# Altium project SwarmBot.PrjPcb
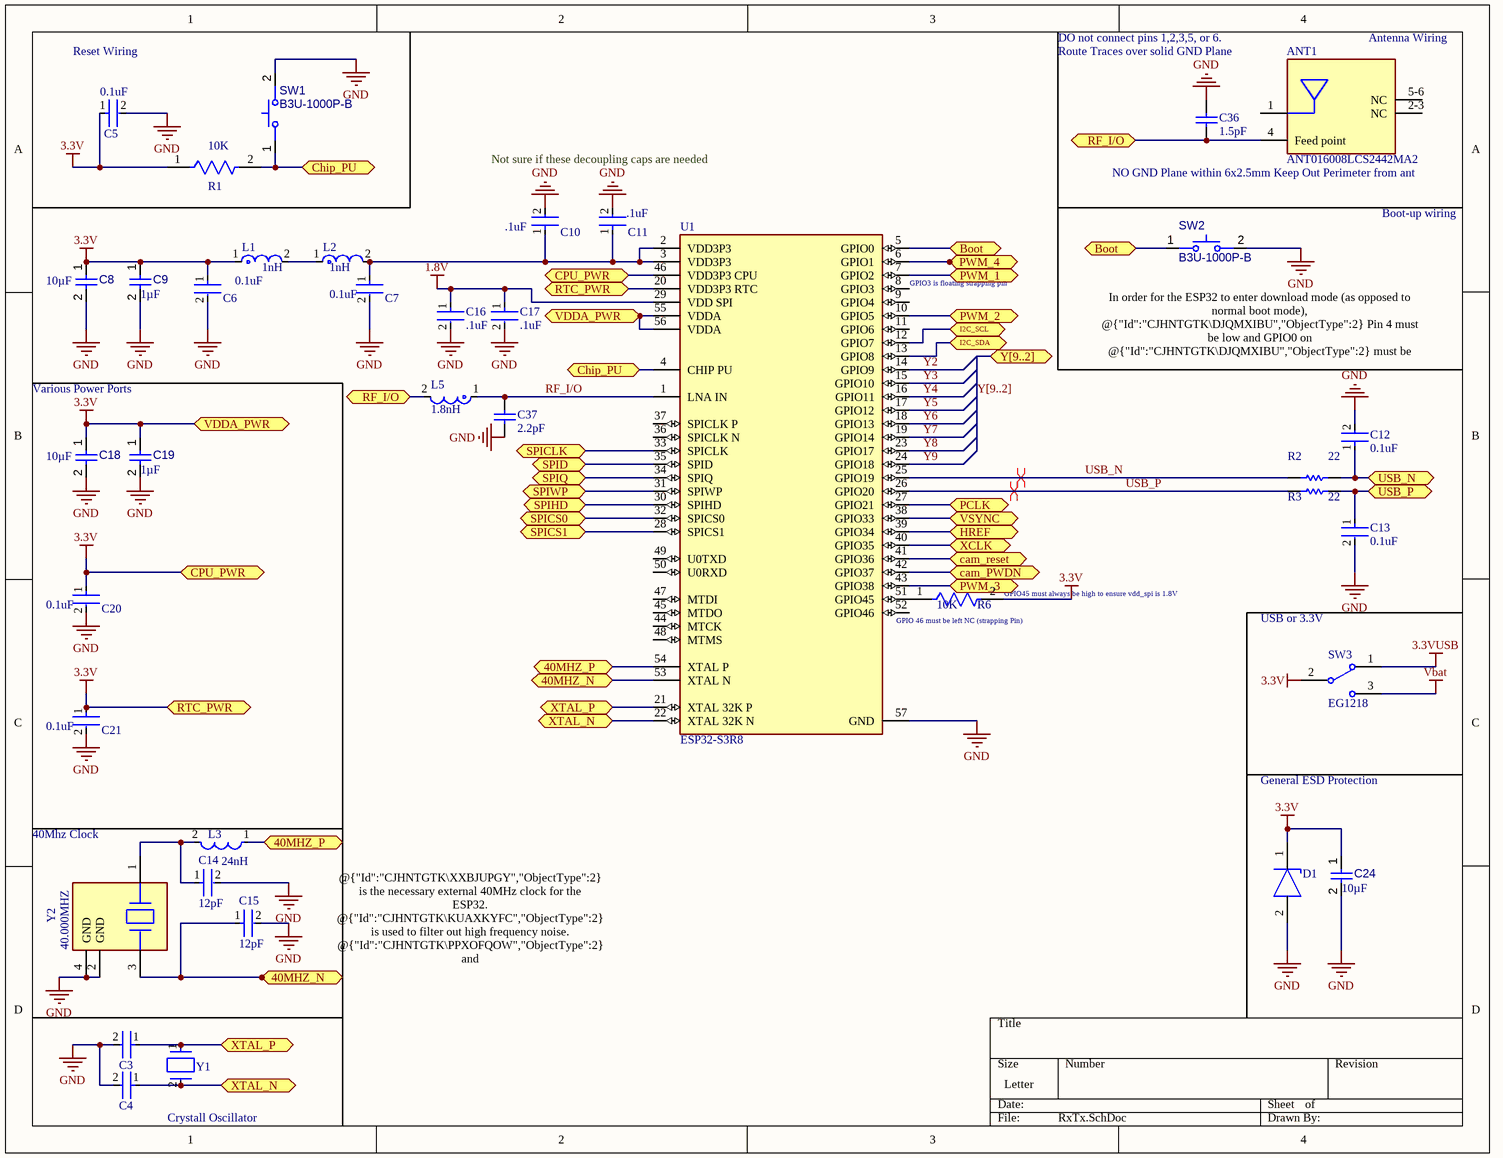
[diagram p0: RxTx.SchDoc]
CAGE_CODE: ?????; CONTRACT_NUMBER: <CONTRACT NO>; DOC_NO_ASSY_DWG: <ASSY DWG NO>; DOC_NO_BOM: <BOM DOC NO>; DOC_NO_FAB_DWG: <FAB DWG NO>; DOC_NO_SCH_DWG: <SCH DWG NO>; PCB_2_DEC_TOL: +/-.01; PCB_3_DEC_TOL: +/-.010; PCB_ANG_TOL: +/-1/2; PCB_ASSEMBLY_NO: <PCB ASSY NO>; PCB_CHECKER: - -----; PCB_CHECKER_APP_DATE: --/--/----; PCB_DESIGNER: - -----; PCB_DESIGNER_APP_DATE: --/--/----; PCB_DWG_NO: <PCB DWG NO>; PCB_ENGINEER: - -----; PCB_ENGINEER_APP_DATE: --/--/----; PCB_PART_NUMBER: <PCB PN>; PCB_REV: A; SCH_REV: A
5 sheets, 79 parts. Net scope: flat (ports and power ports of the same name join across sheets).
Board files: SwarmBotv1.PcbDoc, SwarmBotV2.PcbDoc
Sheets:
  RxTx.SchDoc
  Cam.SchDoc
  USB.SchDoc
  PowerReg.SchDoc
  Flash&PSRAM.SchDoc

## Sheet RxTx.SchDoc
size Letter; ENG_APP_DATE: --/--/--; DSN_APP_DATE: --/--/--; CHK_APP_DATE: --/--/--; SheetNumber: 1; SheetTotal: 5

### Parts
ANT1  ANT016008LCS2442MA2  [FP-ANT016008LCS2442MA2-0]
C3  GRM21A5C2E120FW01D  [FP-GRM21A-0_2-IPC_C]  (value not drawn)
C4  GRM21A5C2E120FW01D  [FP-GRM21A-0_2-IPC_C]  (value not drawn)
C5  0.1uF  [FP-GRM033-0_03-IPC_A]
C6  0.1uF  [FP-GRM033-0_03-IPC_A]
C7  0.1uF  [FP-GRM033-0_03-IPC_A]
C8  value 10µF  [CAPC0603(1608)100_L]  (hidden comment: Capacitor 10µF +/-20% 10V 0603)
C9  value 1µF  [CAPC1608X90X35ML15T15]  (hidden comment: Capacitor 1uF +/- 10% 16V 0603)
C10  .1uF  [FP-GRM033-0_03-IPC_A]
C11  .1uF  [FP-GRM033-0_03-IPC_A]
C12  0.1uF  [FP-GRM033-0_03-IPC_A]
C13  0.1uF  [FP-GRM033-0_03-IPC_A]
C14  12pF  [FP-GRM31A-0_2-e0_3_0_95-MFG]
C15  12pF  [FP-GRM31A-0_2-e0_3_0_95-MFG]
C16  .1uF  [FP-GRM033-0_03-IPC_A]
C17  .1uF  [FP-GRM033-0_03-IPC_A]
C18  value 10µF  [CAPC0603(1608)100_L]  (hidden comment: Capacitor 10µF +/-20% 10V 0603)
C19  value 1µF  [CAPC1608X90X35ML15T15]  (hidden comment: Capacitor 1uF +/- 10% 16V 0603)
C20  0.1uF  [FP-GRM033-0_03-IPC_A]
C21  0.1uF  [FP-GRM033-0_03-IPC_A]
C24  value 10µF  [CAPC0603(1608)100_L]  (hidden comment: Capacitor 10µF +/-20% 10V 0603)
C36  1.5pF  [CAPC0402(1005)60_M]
C37  2.2pF  [CAPC0402(1005)60_L]
D1  PTVS3V3P1UP,115  [FP-SOD128-MFG]  (value not drawn)
L1  1nH  [FP-LQG15HH_02-IPC_C]
L2  1nH  [FP-LQG15HH_02-IPC_C]
L3  24nH  [FP-LQW15AN_00-W0_5-0_1-MFG]
L5  1.8nH  [FP-LQG15HH_02-IPC_C]
R1  10K  [FP-CRGP0805-IPC_C]
R2  22  [RESC1005X40X25LL05T10]
R3  22  [RESC1005X40X25LL05T10]
R6  10K  [FP-CRGP0805-IPC_C]
SW1  B3U-1000P-B  [OMRON-B3U-1000P-2-B_V]
SW2  B3U-1000P-B  [OMRON-B3U-1000P-2-B_V]
SW3  EG1218  [ESWI-EG1218_V]
U1  ESP32-S3R8  [FP-ESP32-S3R8-IPC_A]
Y1  ABS07-32.768KHZ-9-T  [FP-ABS07-MFG]  (value not drawn)
Y2  40.000MHZ  [FP-ABM8-MFG]

### Ports
40MHZ_N (bidir), 40MHZ_P (bidir), Boot (bidir), cam_PWDN (bidir), cam_reset (bidir), Chip_PU (bidir), CPU_PWR (bidir), HREF (bidir), I2C_SCL (bidir), I2C_SDA (bidir), PCLK (bidir), PWM_1 (bidir), PWM_2 (bidir), PWM_3 (bidir), PWM_4 (bidir), RF_I/O (bidir), RTC_PWR (bidir), SPICLK (bidir), SPICS0 (bidir), SPICS1 (bidir), SPID (bidir), SPIHD (bidir), SPIQ (bidir), SPIWP (bidir), USB_N (bidir), USB_P (bidir), VDDA_PWR (bidir), VSYNC (bidir), XCLK (bidir), XTAL_N (bidir), XTAL_P (bidir), Y[9..2] (bidir)

### Nets
1.8V: C16.1 C17.1 U1.29(VDD_SPI)
3.3V: C5.1 C6.1 C8.1 C9.1 C18.1 C19.1 C20.1 C21.1 C24.1 D1.1(C) L1.1 R1.1 R6.2 SW3.2(COM) U1.20(VDD3P3_RTC) U1.46(VDD3P3_CPU) U1.55(VDDA) U1.56(VDDA) ; port VDDA_PWR, port CPU_PWR, port RTC_PWR
3.3VUSB: SW3.1
GND: C3.2 C4.2 C5.2 C6.2 C7.2 C8.2 C9.2 C10.2 C11.2 C12.2 C13.2 C14.2 C15.2 C16.2 C17.2 C18.2 C19.2 C20.2 C21.2 C24.2 C36.2 C37.2 D1.2(A) SW1.2 SW2.2 U1.57(GND) Y2.2(GND) Y2.4(GND)
Vbat: SW3.3
cam_reset: U1.41(GPIO36) ; port cam_reset
href: U1.39(GPIO34) ; port HREF
pclk: U1.27(GPIO21) ; port PCLK
pwdn: U1.42(GPIO37) ; port cam_PWDN
RF_I/O: C37.1 L5.1 U1.1(LNA_IN)
SCL: U1.12(GPIO7) ; port I2C_SCL
SDA: U1.13(GPIO8) ; port I2C_SDA
USB1_N: C12.1 R2.2 ; port USB_N
USB1_P: C13.1 R3.2 ; port USB_P
USB_N: R2.1 U1.25(GPIO19)
USB_P: R3.1 U1.26(GPIO20)
vsync: U1.38(GPIO33) ; port VSYNC
xclk: U1.40(GPIO35) ; port XCLK
Y2: U1.14(GPIO9)
Y3: U1.15(GPIO10)
Y4: U1.16(GPIO11)
Y5: U1.17(GPIO12)
Y6: U1.18(GPIO13)
Y7: U1.19(GPIO14)
Y8: U1.23(GPIO17)
Y9: U1.24(GPIO18)
NetANT1_4: ANT1.4(Feed_point) C36.1 L5.2 ; port RF_I/O
NetC3_1: C3.1 U1.21(XTAL_32K_P) Y1.1 ; port XTAL_P
NetC4_1: C4.1 U1.22(XTAL_32K_N) Y1.2 ; port XTAL_N
NetC7_1: C7.1 C10.1 C11.1 L2.2 U1.2(VDD3P3) U1.3(VDD3P3)
NetC14_1: C14.1 L3.2 Y2.1
NetC15_1: C15.1 U1.53(XTAL_N) Y2.3 ; port 40MHZ_N
NetL1_2: L1.2 L2.1
NetL3_1: L3.1 U1.54(XTAL_P) ; port 40MHZ_P
NetP1_2: U1.7(GPIO2) ; port PWM_1
NetP2_2: U1.10(GPIO5) ; port PWM_2
NetP3_2: U1.43(GPIO38) ; port PWM_3
NetP4_2: U1.6(GPIO1) ; port PWM_4
NetR1_2: R1.2 SW1.1 U1.4(CHIP_PU) ; port Chip_PU
NetR6_1: R6.1 U1.51(GPIO45)
NetSW2_1: SW2.1 U1.5(GPIO0) ; port Boot
NetU1_28: U1.28(SPICS1) ; port SPICS1
NetU1_30: U1.30(SPIHD) ; port SPIHD
NetU1_31: U1.31(SPIWP) ; port SPIWP
NetU1_32: U1.32(SPICS0) ; port SPICS0
NetU1_33: U1.33(SPICLK) ; port SPICLK
NetU1_34: U1.34(SPIQ) ; port SPIQ
NetU1_35: U1.35(SPID) ; port SPID

Not connected (* = marked no-connect by the designer): ANT1 1(Radiator_electrode) 2-3(NC) 5-6(NC); U1 8(GPIO3) 9(GPIO4) 11(GPIO6) 36(SPICLK_N) 37(SPICLK_P) 44(MTCK) 45(MTDO) 47(MTDI) 48(MTMS) 49(U0TXD) 50(U0RXD) 52(GPIO46)

### Buses and harness runs
bus Y[9..2] = port Y[9..2]

### Layout directives
differential pair: USB_N, USB_P

### Notes on the sheet
- Reset Wiring
- DO not connect pins 1,2,3,5, or 6.
- Route Traces over solid GND Plane
- Antenna Wiring
- Not sure if these decoupling caps are needed
- NO GND Plane within 6x2.5mm Keep Out Perimeter from ant
- Boot-up wiring
- (near U1) GPIO3 is floating strapping pin
- Type @ to refer to a designator
- (near SW2) In order for the ESP32 to enter download mode (as opposed to normal boot mode), @{"Id":"CJHNTGTK\DJQMXIBU","ObjectType":2} Pin 4 must be low and GPIO0 on @{"Id":"CJHNTGTK\DJQMXIBU","ObjectType":2} must be low. In order to achieve this press @{"Id":"CJHNTGTK\SEUIVYGS","ObjectType":2} & @{"Id":"CJHNTGTK\DHJPIHSD","ObjectType":2} @ the same time as GPIO0 is a strapping pin and has an internal PU Resistor.
- Various Power Ports
- GPIO 46 must be left NC (strapping Pin)
- (near R6) GPIO45 must always be high to ensure vdd_spi is 1.8V
- (near SW3) USB or 3.3V
- (near Y2) 40Mhz Clock
- General ESD Protection
- @{"Id":"CJHNTGTK\XXBJUPGY","ObjectType":2} is the necessary external 40MHz clock for the ESP32. @{"Id":"CJHNTGTK\KUAXKYFC","ObjectType":2} is used to filter out high frequency noise. @{"Id":"CJHNTGTK\PPXOFQOW","ObjectType":2} and @{"Id":"CJHNTGTK\RYRNBWFY","ObjectType":2} are assuming a C_stray of 4pF and using CL = C1/2 + C_stray for the formula. (This formula assumes the two capacitors have the same value).
- Crystall Oscillator

### Library data of the parts
ANT1 = CMP-08339-000002-1: RF ANT 2.4GHZ CHIP SOLDER SMD; Manufacturer: TDK Corporation; Max Frequency: 2484MHz; Impedance: 50Ω; Number Of Bands: 1; Bandwidth: 2400-2484MHz; Temperature: -40°C to +85°C; Device Class L1: Integrated Circuits (ICs); Lead Free: Yes; ComponentLink2Description: Datasheet; RoHS: TRUE; Temperature Range High: +85°C; Package: ANT016008LCS2442MA2; Temperature Range Low: -40°C; ComponentLink2URL: https://product.tdk.com/info/en/documents/data_sheet/rf_ant_ant016008lcs2442ma2_summary_en.pdf; Height: 0.4mm; Octopart: https://octopart.com/ant016008lcs2442ma2-tdk-48293801; Device Class L3: RF Antennas; Device Class L2: RF Semiconductors and Devices; Digikey Description: RF ANT 2.4GHZ CHIP SOLDER SMD; Category: Ant; Automotive: No; Manufacturer Part Number: ANT016008LCS2442MA2
C3 C4 = CMP-06035-038672-1: Chip Multilayer Ceramic Capacitors for General Purpose, 0805, 12pF, C0G, 30ppm/°C, 1%, 250V
C5-C7 C10-C13 C16 C17 C20 C21 = CMP-06035-043202-1: Chip Multilayer Ceramic Capacitors for General Purpose, 0201, 0.10uF, X7R, 15%, 10%, 16V
C8 C18 C24 = CMP-001-00075-4: Chip Capacitor, 10µF +/-20%, 10V, 0603, Thickness 1 mm; Tolerance: 10%; Voltage Rating: 10V; Max Operating Temperature: 85°C; Pins: 2; Case/Package: 0603; Mounting Technology: SMT; Min Operating Temperature: -55°C
C9 C19 = CMP-001-00004-6: Chip Capacitor, 1 uF, +/- 10%, 16 V, 0603 (1608 Metric); Capacitor Type: Ceramic; Mounting Technology: SM; RoHS Compliant: True; Min Operating Temperature: -55°C; Case/Package: 0603; Pins: 2; Voltage Rating: 16V; Max Operating Temperature: 125°C; Tolerance: 10%
C14 C15 = CMP-06035-037569-1: Chip Multilayer Ceramic Capacitors for General Purpose, 1206, 12pF, C0G, 30ppm/°C, 5%, 1kV; Thickness: 0.039inch; Termination: SMD/SMT; Package Quantity: 4000; Dielectric: C0G; Case Code (Imperial): 1206; Width: 1.6mm; Height: 1mm; Packaging: Tape and Reel; Voltage Rating (DC): 1kV; Max Operating Temperature: 125°C; Case Code (Metric): 3216; Capacitance: 12pF; Length: 0.126inch; Case/Package: 1206; Voltage Rating: 1kV; Min Operating Temperature: -55°C; Mount: Surface Mount; Tolerance: 5%
C36 = CMP-1034-00102-1: CAP 1.5pF 10V ±0.1pF 0402 (1005 Metric) Thickness 0.6mm SMD; Case-EIA: 0402; Tolerance: Â±0.1pF; Case-Metric: 1005; Rated Voltage: 10 V; Technology: SMT; Value: 1.5pF; Max Thickness: 0.6 mm
C37 = CMP-1034-00170-1: CAP 2.2pF 25V ±0.1pF 0402 (1005 Metric) Thickness 0.6mm SMD; Case-EIA: 0402; Case-Metric: 1005; Tolerance: Â±0.1pF; Rated Voltage: 25 V; Max Thickness: 0.6 mm; Technology: SMT; Value: 2.2pF
D1 = CMP-14436-000013-1: TVS DIODE 3.3V 8V CFP5; RoHS Compliant: Yes
L1 L2 = CMP-06042-000103-1: Multilayer type RF Inductor 1nH ±0.3nH 0.07Ω 1000mA 0402; Shielding: Unshielded; DC Current: 300mA; Q Factor: 8; Self Resonant Frequency: 6GHz; Core Material: Air; Test Frequency: 100MHz; DC Resistance (DCR): 100mR; Case Code (Imperial): 0402; Max Operating Temperature: 125°C; Max DC Current: 300mA; Mount: Surface Mount; Package Quantity: 1; Current Rating: 300mA; Case Code (Metric): 1005; Number of Pins: 2; Packaging: Tape and Reel; Termination: SMD/SMT; Radiation Hardening: No; Width: 0.5mm; Case/Package: 0402; REACH SVHC: No SVHC; Military Standard: Not; Lead Free: Lead Free; Min Operating Temperature: -55°C; Height - Seated (Max): 0.022inch; Length: 0.039inch; Height: 0.02inch; Inductance: 1nH; Depth: 0.55mm
L3 = CMP-06042-007532-1: Wire Wound RF Inductor 24nH ±2% 280mA 0.52Ω 0402 (1005); Q Factor: 25; Core Material: Air; Test Frequency: 100MHz; Current: 270mA; Self Resonant Frequency: 3.5GHz; Shielding: Unshielded; DC Resistance (DCR): 520mR; Height: 0.5mm; Lead Free: Lead Free; Max DC Current: 280mA; Width: 0.02inch; Number of Pins: 2; Inductance Tolerance: 2%; Military Standard: Not; REACH SVHC: No SVHC; Case Code (Imperial): 0402; Inductance: 24nH; Case/Package: 0402; Current Rating: 280mA; Min Operating Temperature: -55°C; Case Code (Metric): 1005; Length: 1mm; Mount: Surface Mount; DC Current: 280mA; Weight: 2.8E-05oz; Package Quantity: 10000; Termination: SMD/SMT; Packaging: Tape and Reel; Max Operating Temperature: 125°C; Depth: 0.6mm; Tolerance: 2%
L5 = CMP-06042-005877-1: Multilayer type RF Inductor 1.8nH ±0.3nH 0.08Ω 950mA 0402; Self Resonant Frequency: 6GHz; Core Material: Air; DC Current: 300mA; Q Factor: 8; Test Frequency: 100MHz; Shielding: Unshielded; DC Resistance (DCR): 100mR; Inductance: 1.8nH; Packaging: Tape and Reel; Lead Free: Lead Free; Min Operating Temperature: -55°C; Height - Seated (Max): 0.022inch; Case/Package: 0402; Mount: Surface Mount; Package Quantity: 1; Width: 0.02inch; Length: 0.039inch; Max Operating Temperature: 125°C; Depth: 0.55mm; Height: 0.5mm; Radiation Hardening: No; Max DC Current: 300mA; Case Code (Metric): 1005; Termination: SMD/SMT; Military Standard: Not; Current Rating: 300mA; Case Code (Imperial): 0402
R1 R6 = CMP-03211-006861-1: CRGP 0805 10K 1%; Manufacturer Part Number: CRGP0805F10K; Manufacturer: TE; Power Rating: 0.33W; Voltage Rating: 150V; Value: 10KΩ; Tolerance: 0.01; Temperature Coefficient: ±100ppm/°C; ComponentLink2URL: https://www.mouser.com/datasheet/2/418/NG_DS_9-1773463-9_A-1358566.pdf; Temperature Range Low: -55°C; Ipc Land Pattern Name: RESC200125X55; Device Class L2: Resistors; Automotive: No; Device Class L3: Chip SMD Resistors; Composition: Thick Film; Temperature Range High: +155°C; Temperature: -55°C to +155°C; Height: 0.65mm; Series: CRGP; RoHS: TRUE; Device Class L1: Passive Components; Octopart: https://octopart.com/crgp0805f10k-te+connectivity-91018782; Package: CRGP0805; Digikey Description: CRGP 0805 10K 1%; Ambient Temperature Range High: +70°C; Lead Free: Yes; ComponentLink2Description: Datasheet; Category: Res; Resistance: 10KΩ
R2 R3 = CMP-2002-08075-1: Part Number: RC0402JR-1322RL; Manufacturer: Yageo
SW1 SW2 = CMP-011-00011-3: Ultra-small Surface-mounting Tactile Switches with High Contact Reliability, SPST-NO, -25 to 70 degC, 2-Pin SMD, RoHS, Tape and Reel; Voltage Rating: 12V; Current Rating: 50mA; Pins: 2; RoHS Compliant: Details
SW3 = CMP-011-00006-2: Slide Switch, SPDT, 500 V, -20 to 70 degC, 3-Pin THD, RoHS, Bulk; Manufacturer: E-Switch; Voltage Rating (DC): 30V; Current Rating: 200mA; Operating Force: 250gf; Package Quantity: 1000; Contact Plating: Silver; Max Operating Temperature: 70°C; Min Operating Temperature: -20°C; Contact Material: Copper; Datasheet URL: https://www.e-switch.com/system/asset/product_line/data_sheet/119/EG.pdf; Contact Finish: Silver; Case/Package: EG1218; Voltage Rating (AC): 30V; Datasheet Version: Oct-15; Package Description: 3-Pin Through Hole Device, Body 11.6 x 4 mm, Pitch 2.5 mm; RoHS Compliant: True; Package Reference: EG1218; Manufacturer URL: http://www.e-switch.ch/en/; Throw Configuration: SPDT; Contact Current Rating: 200mA; Mounting Technology: TH; Packaging: Bulk; Pins: 3
U1 = CMP-10700-118292493-1: ESP32-S3R8 RF System on a Chip - SoC SMD IC, Dual-Core MCU, Wi-Fi 2.4G BLE 5.0 Combo; NexarPartId: 118292493
Y1 = CMP-27762-013661-2: Crystal 32.768kHz ±20ppm (Tol) 9pF FUND 70kΩ 2-Pin CSMD T/R; Insulation Resistance: 500MR; Series Resistance: 70kR; Packaging: Tape and Reel; Length: 3.2mm; Max Operating Temperature: 85°C; Mount: Surface Mount; Height: 0.9mm; Number of Pins: 2; Depth: 1.5mm; Series: ABS07; REACH SVHC: No SVHC; Tolerance: 20ppm; Radiation Hardening: No; Case/Package: CSMD; Package Quantity: 3000; Termination: SMD/SMT; Operating Frequency: 32.768 kHz; Width: 1.5mm; Load Capacitance: 9pF; Lead Free: Lead Free; Frequency Tolerance: 20ppm; Frequency Stability: 20ppm; Frequency: 32.768kHz; ESR (Equivalent Series Resistance): 70kR; RoHS Compliant: Yes; Min Operating Temperature: -40°C
Y2 = CMP-27762-008947-1: Crystal 40MHz ±10ppm 10pF SMD-4 3.2mm x 2.5mm; ESR (Equivalent Series Resistance): 35R; Frequency: 40MHz; Number of Pins: 4; Frequency Stability: 10ppm; Radiation Hardening: No; Tolerance: 10ppm; Min Operating Temperature: -10°C; Resistor Type: Ceramic; Width: 0.098inch; Max Operating Temperature: 60°C; Case/Package: SMD/SMT; Packaging: Tape and Reel; Mount: Surface Mount; Termination: SMD/SMT; Load Capacitance: 10pF; Series: ABM8; Height: 0.031inch; Frequency Tolerance: 10ppm; Operating Frequency: 40 MHz; Package Quantity: 1000; Length: 0.126inch; Lead Free: Lead Free

## Sheet Cam.SchDoc
size Letter; SheetNumber: 2; SheetTotal: 5
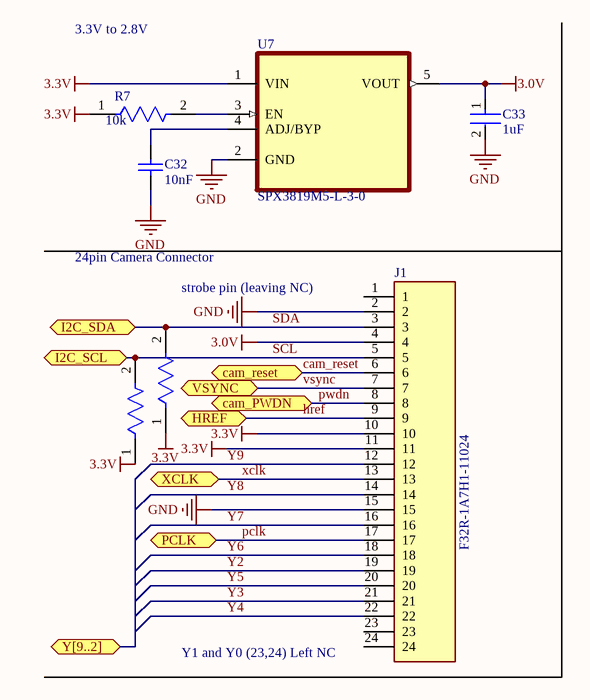
[diagram p1: Cam.SchDoc]

### Parts
C32  10nF  [CAPC2013X140X50LL20T25]
C33  1uF  [FP-RCE1K1-MFG]
J1  F32R-1A7H1-11024  [AMPHENOL_F32R-1A7H1-11024]
R7  10k  [FP-CPF0603-MFG]
R11  AC0603JR-7W10KL  [FP-AC0603-IPC_A]  (value not drawn)
R12  AC0603JR-7W10KL  [FP-AC0603-IPC_A]  (value not drawn)
U7  SPX3819M5-L-3-0  [SOT95P280X145-5N]

### Ports
cam_PWDN (bidir), cam_reset (bidir), HREF (bidir), I2C_SCL (bidir), I2C_SDA (bidir), PCLK (bidir), VSYNC (bidir), XCLK (bidir), Y[9..2] (bidir)

### Nets
3.0V: C33.1 J1.4 U7.5(VOUT)
3.3V: J1.10 J1.11 R7.1 R11.1 R12.1 U7.1(VIN)
GND: C32.2 C33.2 J1.2 J1.15 U7.2(GND)
cam_reset: J1.6 ; port cam_reset
href: J1.9 ; port HREF
pclk: J1.17 ; port PCLK
pwdn: J1.8 ; port cam_PWDN
SCL: J1.5 R11.2 ; port I2C_SCL
SDA: J1.3 R12.2 ; port I2C_SDA
vsync: J1.7 ; port VSYNC
xclk: J1.13 ; port XCLK
Y2: J1.19
Y3: J1.21
Y4: J1.22
Y5: J1.20
Y6: J1.18
Y7: J1.16
Y8: J1.14
Y9: J1.12
NetC32_1: C32.1 U7.4(ADJ/BYP)
NetR7_2: R7.2 U7.3(EN)

Not connected (* = marked no-connect by the designer): J1 1 23 24

### Notes on the sheet
- 3.3V to 2.8V
- 24pin Camera Connector
- strobe pin (leaving NC)
- (near J1) Y1 and Y0 (23,24) Left NC

### Library data of the parts
C32 = CMP-2007-04788-1: Part Number: 08055F103KAT2A; Manufacturer: AVX Interconnect / Elco
C33 = CMP-00260-148573931-1: RCEC72A105K1K1H03B; Capacitance: 1µF; Tolerance: 10%; Material: Ceramic; Voltage Rating: 100V; Min Operating Temperature: -55°C; Case/Package: Radial; Max Operating Temperature: 125°C; Lifecycle Status: Production; Height: 5mm
J1 = CMP-002-00071-1: Flex Connector, 0.50mm Pitch, Height 2.00mm, Right angle, Slider type, ZIF, Bottom contact, 24 position , Without MYLAR; MF: Amphenol ICC / Aorora; Check_prices: https://www.snapeda.com/parts/F32R-1A7H1-11024/Amphenol/view-part/?ref=eda; Design Item ID: F32R-1A7H1-11024; SnapEDA_Link: https://www.snapeda.com/parts/F32R-1A7H1-11024/Amphenol/view-part/?ref=snap; Source: F32R-1A7H1-11024.SchLib; Pins: 24; Case/Package: None; MP: F32R-1A7H1-11024; Component Type: Standard; Value: *
R7 = CMP-03211-003506-1: RES SMD 10KΩ 0.5% 1/16W 0603; Manufacturer: TE Connectivity; Manufacturer Part Number: CPF0603D10KE; Power Rating: 0.063W; Temperature Coefficient: 25ppm/°C; Voltage Rating: 50V; ComponentLink2Description: Datasheet; packaging: 5k Reel; Automotive: No; Octopart: https://octopart.com/cpf0603d10ke-te+connectivity-22737789; Composition: Thin Film; Value: 10KΩ; Category: Res; RoHS: TRUE; Height: 0.55mm; Lead Free: Yes; ComponentLink2URL: https://www.te.com/commerce/DocumentDelivery/DDEController?Action=showdoc&DocId=Data+Sheet%7F1773200%7FM%7Fpdf%7FEnglish%7FENG_DS_1773200_M.pdf%7F3-1676481-2; Temperature: -55°C to +155°C; Device Class L3: Chip SMD Resistors; Device Class L1: Passive Components; octopart_url: https://octopart.com/cpf0603d10ke-te+connectivity-22737789; Tolerance: 0.5%; Resistance: 10KΩ; Package: CPF0603; Temperature Range High: +155°C; Series: CPF; Temperature Range Low: -55°C; Device Class L2: Resistors; Ipc Land Pattern Name: RESC15580X45
R11 R12 = CMP-03412-040683-1: RES 10kΩ 5.00% 0.2W 0603
U7 = CMP-031-00008-1: Linear Voltage Regulator IC Positive Fixed 1 Output 500mA SOT-23-5; MF: MaxLinear, Inc.; Pins: 5; MP: SPX3819M5-L-3-0; Source: SPX3819M5-L-3-0.SchLib; Case/Package: SOT-23-5 Exar; Check_prices: https://www.snapeda.com/parts/SPX3819M5-L-3-0/MaxLinear/view-part/?ref=eda; Design Item ID: SPX3819M5-L-3-0; SnapEDA_Link: https://www.snapeda.com/parts/SPX3819M5-L-3-0/MaxLinear/view-part/?ref=snap; Component Type: Standard; Value: *

## Sheet USB.SchDoc
size Letter; SheetNumber: 3; SheetTotal: 5
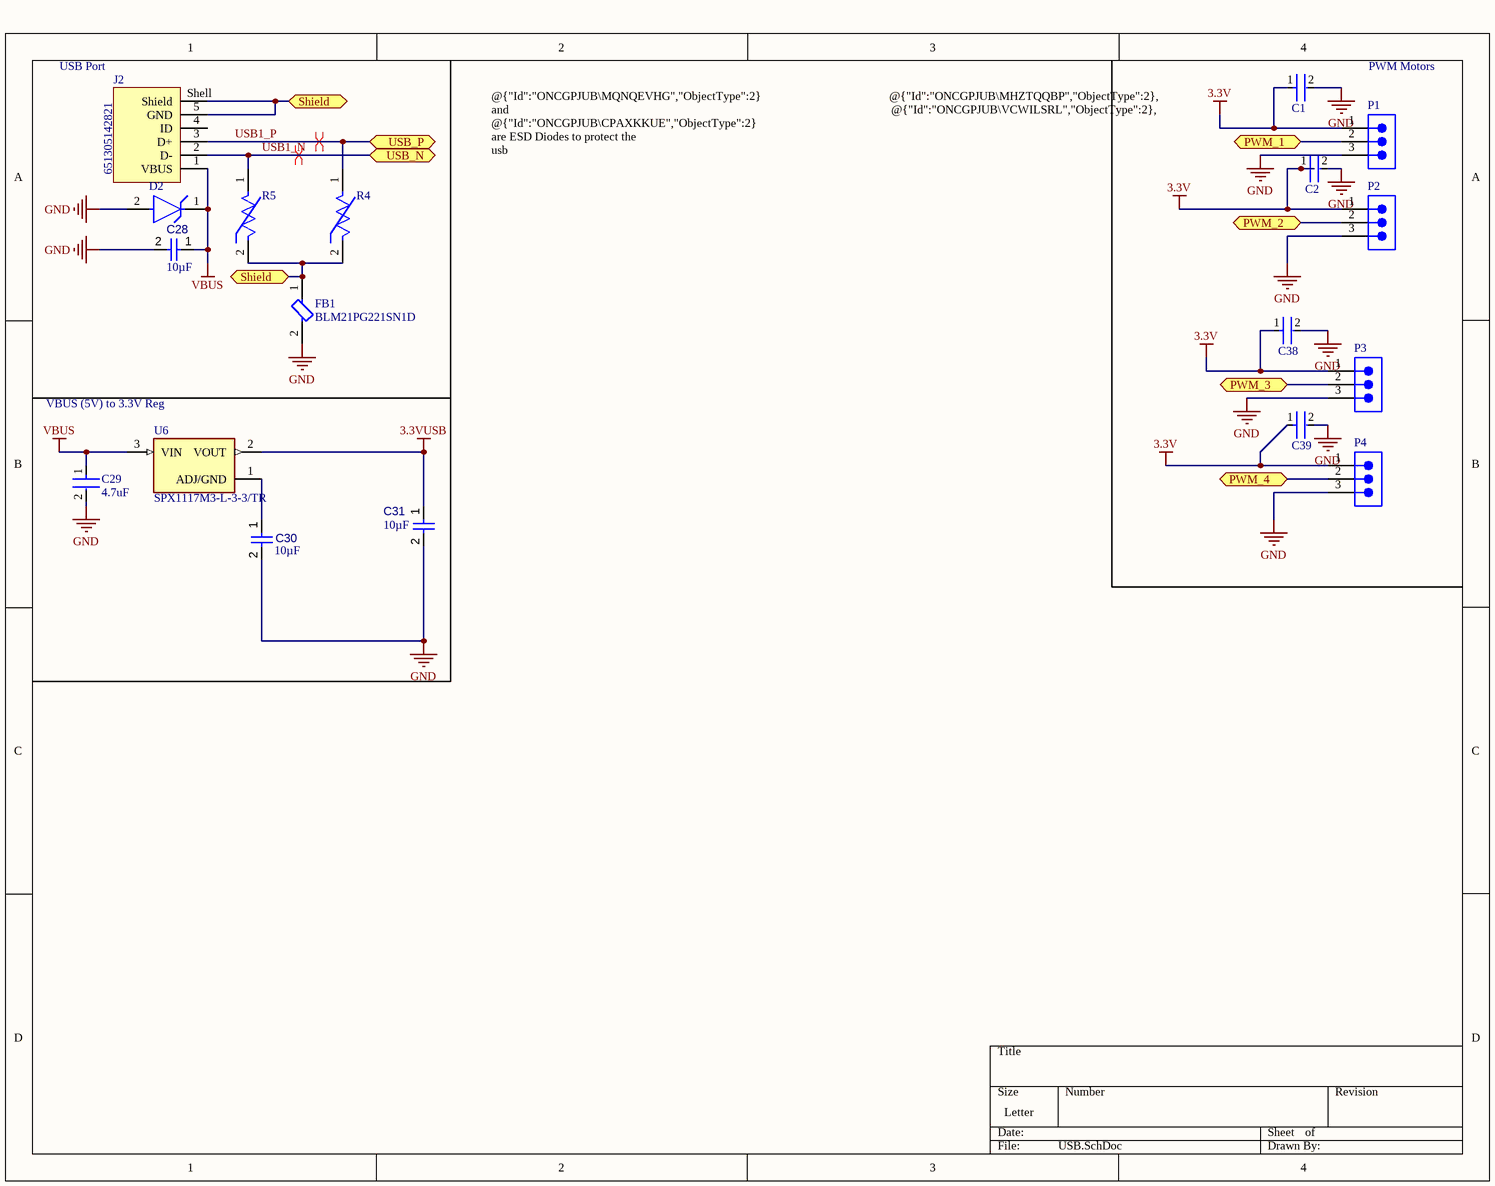
[diagram p2: USB.SchDoc]

### Parts
C1  GRM033Z71C104KE14J  [FP-GRM033-0_03-IPC_A]  (value not drawn)
C2  GRM033Z71C104KE14J  [FP-GRM033-0_03-IPC_A]  (value not drawn)
C28  value 10µF  [CAPC0603(1608)100_L]  (hidden comment: Capacitor 10µF +/-20% 10V 0603)
C29  4.7uF  [FP-RDE3P1-MFG]
C30  value 10µF  [CAPC0603(1608)100_L]  (hidden comment: 10uF)
C31  value 10µF  [CAPC0603(1608)100_L]  (hidden comment: 10uF)
C38  GRM033Z71C104KE14J  [FP-GRM033-0_03-IPC_A]  (value not drawn)
C39  GRM033Z71C104KE14J  [FP-GRM033-0_03-IPC_A]  (value not drawn)
D2  TVS305E3  [FP-BODY-A-MFG]  (value not drawn)
FB1  BLM21PG221SN1D  [FP-BLM21-0_2-t0_85-e0_5-IPC_B]
J2  651305142821  [651305142821]
P1  61300311121  [61300311121]  (value not drawn)
P2  61300311121  [61300311121]  (value not drawn)
P3  61300311121  [61300311121]  (value not drawn)
P4  61300311121  [61300311121]  (value not drawn)
R4  CG0603MLC-05LE  [FP-CG0603-MFG]  (value not drawn)
R5  CG0603MLC-05LE  [FP-CG0603-MFG]  (value not drawn)
U6  SPX1117M3-L-3-3/TR  [SOT230P700X180-3N]

### Ports
PWM_1 (bidir), PWM_2 (bidir), PWM_3 (bidir), PWM_4 (bidir), Shield (bidir), USB_N (bidir), USB_P (bidir)

### Nets
3.3V: C1.1 C2.1 C38.1 C39.1 P1.1 P2.1 P3.1 P4.1
3.3VUSB: C31.1 U6.2(VOUT)
GND: C1.2 C2.2 C28.2 C29.2 C30.2 C31.2 C38.2 C39.2 D2.2(A) FB1.2 P1.3 P2.3 P3.3 P4.3
VBUS: C28.1 C29.1 D2.1(C) J2.1(VBUS) U6.3(VIN)
USB1_N: J2.2(D-) R5.1 ; port USB_N
USB1_P: J2.3(D+) R4.1 ; port USB_P
NetC30_1: C30.1 U6.1(ADJ/GND)
NetFB1_1: FB1.1 J2.5(GND) J2.Shell(Shield) R4.2 R5.2 ; port Shield
NetP1_2: P1.2 ; port PWM_1
NetP2_2: P2.2 ; port PWM_2
NetP3_2: P3.2 ; port PWM_3
NetP4_2: P4.2 ; port PWM_4

Not connected (* = marked no-connect by the designer): J2 4(ID)

### Layout directives
differential pair: USB1_N, USB1_P

### Notes on the sheet
- USB Port
- @{"Id":"ONCGPJUB\MHZTQQBP","ObjectType":2}, @{"Id":"ONCGPJUB\VCWILSRL","ObjectType":2}, @{"Id":"ONCGPJUB\JLPVZJUW","ObjectType":2}, and @{"Id":"ONCGPJUB\LRMUBTTG","ObjectType":2} are used for PWM Motors
- PWM Motors
- @{"Id":"ONCGPJUB\MQNQEVHG","ObjectType":2} and @{"Id":"ONCGPJUB\CPAXKKUE","ObjectType":2} are ESD Diodes to protect the usb
- (near U6) VBUS (5V) to 3.3V Reg

### Library data of the parts
C1 C2 C38 C39 = CMP-06035-043202-1: as C5 on sheet RxTx
C28 C30 C31 = CMP-001-00075-4: as C8 on sheet RxTx; Voltage Rating: 10V; Max Operating Temperature: 85°C; Pins: 2; Case/Package: 0603; Mounting Technology: SMT; Min Operating Temperature: -55°C
C29 = CMP-00260-148573962-1: RDEC72A475K3P1H03B; Voltage Rating: 100V; Material: Ceramic; Capacitance: 4.7µF; Tolerance: 10%; Case/Package: Radial; Height: 7.5mm; Lifecycle Status: Production; Min Operating Temperature: -55°C; Max Operating Temperature: 125°C
D2 = CMP-00252-101806678-1: TVS305E3 Uni-Directional Tvs A-Body Rohs Compliant: Yes; Direction: Unidirectional; Number of Channels: 1; Clamping Voltage: 8.7V; Breakdown Voltage: 6V; Reverse Standoff Voltage: 5V; Peak Pulse Current: 17A; Peak Pulse Power: 150W; NexarPartId: 101806678; Case/Package: Axial; Max Operating Temperature: 175°C; Min Operating Temperature: -65°C; Height: 2.16mm
FB1 = CMP-0686-00610-3: Chip Ferrite Bead, 0805, 220Ω @ 100MHz, 0.045Ω, 25%, 2A; Number of Circuits: 1; Shielding: Unshielded; DC Resistance (DCR): 45mR; Impedance: 220R; Radiation Hardening: No; Material: Ferrite; Frequency: 100MHz; Width: 1.25mm; DC Current: 2A; Max DC Current: 2A; Number of Lines: 1; Package Quantity: 1; Case Code (Metric): 2012; Current Rating: 2A; Case/Package: 0805; Current: 2A; Military Standard: Not; Core Material: Ferrite; Depth: 1.25mm; Contact Plating: Tin; DC Resistance-Max: 45mR; Max Operating Temperature: 125°C; Length: 2mm; Max Current Rating: 2A; REACH SVHC: No SVHC; Termination: SMD/SMT; Min Operating Temperature: -55°C; Series: BLM21P; Test Frequency: 100MHz; Tolerance: 25%; Number of Pins: 2; RoHS Compliant: Yes; Height: 0.85mm; Packaging: Tape and Reel; Lead Free: Lead Free; Case Code (Imperial): 0805
J2 = CMP-1502-03247-2: NexarPartId: 19991175; Operating Supply Voltage: 30V; Current Rating: 1A; Contact Resistance: 20mΩ; Connector Type: USB; Number of Contacts: 5; USB Standard: USB 2.0; Gender: Receptacle; Insulation Resistance: 1GΩ; REACH SVHC: Unknown; Contact Plating: Gold; Min Operating Temperature: -40°C; Features: Shielded; RoHS: Compliant; Contact Material: Copper; Packaging: Tape and Reel; Termination: SMD/SMT; Max Operating Temperature: 105°C; Orientation: Horizontal; Number of Pins: 5; Mount: Horizontal, Surface Mount; Lead Free: Lead Free
P1-P4 = CMP-1502-01062-3: NexarPartId: 32855521; Current Rating: 3A; Voltage Rating: 250V; Number of Positions: 3; Pitch: 2.54mm; Contact Resistance: 20mΩ; Connector Type: Male Pin; Gender: Male; REACH SVHC: Unknown; Packaging: Bulk; Contact Material: Copper; Min Operating Temperature: -40°C; Number of Rows: 1; Orientation: Vertical; RoHS: Compliant; Contact Plating: Gold; Max Operating Temperature: 105°C; Mount: Through Hole; Height: 8.94mm; Operating Supply Voltage: 250V; Number of Pins: 3; Contact Mating Length: 5.9944mm; Number of Contacts: 3; Color: Black; Lead Free: Lead Free; Lead Pitch: 2.54mm; Termination: Solder
R4 R5 = CMP-07402-000005-1: VARISTOR 0603; Manufacturer: Bourns Inc.; Clamping Voltage: 25V; Varistor Voltage: 5V; Esd Protec Present: true; Value: 0.5pF; Digikey Description: VARISTOR 0603; Device Class L3: unset; Lead Free: Yes; RoHS: TRUE; Category: Res; Manufacturer Part Number: CG0603MLC-05LE; Height: 0.55mm; Temperature Range Low: -40°C; Mouser Description: ESD Suppressors Chip Guard 0603 5 Volts; Temperature Range High: +85°C; ComponentLink2URL: https://www.bourns.com/docs/Product-Datasheets/MLC.pdf; Automotive: No; Octopart: https://octopart.com/cg0603mlc-05le-bourns-7576245; Temperature: -40°C to +85°C; Ipc Land Pattern Name: RESC16080X45; ComponentLink2Description: Datasheet; Device Class L2: Varistors; Capacitance: 0.5pF; Package: CG0603; Voltage Rating Dc: 5V; Device Class L1: Circuit Protection
U6 = CMP-031-00007-1: Linear Voltage Regulator IC Positive Fixed 1 Output 800mA SOT-223-3; MF: MaxLinear; Design Item ID: SPX1117M3-L-3-3/TR; Check_prices: https://www.snapeda.com/parts/SPX1117M3-L-3-3/TR/MaxLinear/view-part/?ref=eda; MP: SPX1117M3-L-3-3/TR; SnapEDA_Link: https://www.snapeda.com/parts/SPX1117M3-L-3-3/TR/MaxLinear/view-part/?ref=snap; Pins: 3; Case/Package: SOT-223 MaxLinear; Component Type: Standard; Value: *; Source: SPX1117M3-L-3-3_TR.SchLib

## Sheet PowerReg.SchDoc
size Letter; SheetNumber: 4; SheetTotal: 5
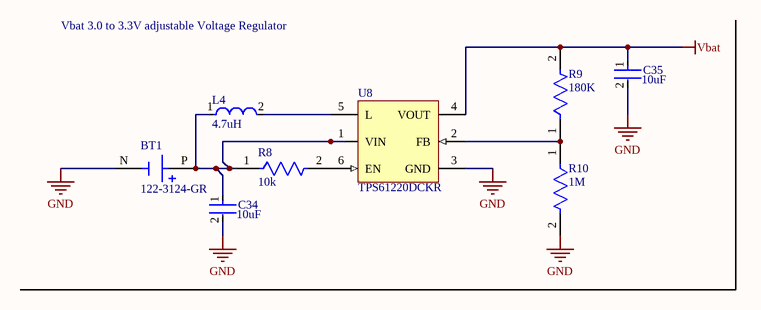
[diagram p3: PowerReg.SchDoc]

### Parts
BT1  122-3124-GR  [BAT_122-3124-GR]
C34  10uF  [FP-CGA6P-IPC_B]
C35  10uF  [FP-CGA6P-IPC_B]
L4  4.7uH  [FP-LBMF1608-0_8-0_2-MFG]
R8  10k  [FP-CPF0603-MFG]
R9  180K  [FP-CRGP0603-IPC_C]
R10  1M  [FP-CRGP0603-IPC_C]
U8  TPS61220DCKR  [DCK0006A_L]

### Nets
GND: BT1.N(NEG) C34.2 C35.2 R10.2 U8.3(GND)
Vbat: C35.1 R9.2 U8.4(VOUT)
NetBT1_P: BT1.P(POS) C34.1 L4.1 R8.1 U8.1(VIN)
NetL4_2: L4.2 U8.5(L)
NetR8_2: R8.2 U8.6(EN)
NetR9_1: R9.1 R10.1 U8.2(FB)

### Notes on the sheet
- Vbat 3.0 to 3.3V adjustable Voltage Regulator

### Library data of the parts
BT1 = CMP-00029-00003-1: Coin Cell Battery Holders CR2477 COIN CELL HL; MF: Eagle Plastic Devices; Value: *; Source: 122-3124-GR.SchLib; Check_prices: https://www.snapeda.com/parts/122-3124-GR/Eagle+Plastic+Devices/view-part/?ref=eda; MP: 122-3124-GR; Case/Package: None; Design Item ID: 122-3124-GR; SnapEDA_Link: https://www.snapeda.com/parts/122-3124-GR/Eagle+Plastic+Devices/view-part/?ref=snap; Component Type: Standard; Price: None; Availability: In Stock; Pins: 2
C34 C35 = CMP-08246-002239-1: Cap Ceramic 10uF 16V X7R 20% Pad SMD 1210 +125°C Automotive T/R; Capacitance: 10uF; Case Code (Metric): 3225; Case/Package: 1210; Termination: SMD/SMT; Tolerance: 20%; Min Operating Temperature: -55°C; Case Code (Imperial): 1210; Max Operating Temperature: 125°C; Packaging: Tape and Reel; Voltage Rating: 16V
L4 = CMP-14484-001029-1: SMD Inductors 4.7uH ±20% 0.11A 0.312Ω 0603; Max DC Current: 110mA; Shielding: Unshielded; Core Material: Ferrite; Test Frequency: 7.96MHz; DC Resistance (DCR): 240mR; Self Resonant Frequency: 45MHz; REACH SVHC: No SVHC; Tolerance: 20%; Package Quantity: 3000; Mount: Surface Mount; Case Code (Imperial): 0603; RoHS Compliant: Yes; Lead Free: Exempt; Height: 0.35mm; Max Operating Temperature: 105°C; Weight: 7.1E-05oz; Halogen Free: Halogen Free; Resistor Type: Wirewound; Width: 0.8mm; Inductance: 4.7uH; Current Rating: 110mA; Radiation Hardening: No; Packaging: Tape and Reel; Case/Package: 0603; Inductance Tolerance: 20%; Height - Seated (Max): 0.039inch; Case Code (Metric): 1608; Lead Pitch: 0.7mm; Termination: SMD/SMT; Depth: 0.9mm; Series: LB; Min Operating Temperature: -40°C; Length: 0.063inch
R8 = CMP-03211-003506-1: as R7 on sheet Cam; ComponentLink2Description: Datasheet; packaging: 5k Reel; Automotive: No; Octopart: https://octopart.com/cpf0603d10ke-te+connectivity-22737789; Composition: Thin Film; Value: 10KΩ; Category: Res; RoHS: TRUE; Height: 0.55mm; Lead Free: Yes; ComponentLink2URL: https://www.te.com/commerce/DocumentDelivery/DDEController?Action=showdoc&DocId=Data+Sheet%7F1773200%7FM%7Fpdf%7FEnglish%7FENG_DS_1773200_M.pdf%7F3-1676481-2; Temperature: -55°C to +155°C; Device Class L3: Chip SMD Resistors; Device Class L1: Passive Components; octopart_url: https://octopart.com/cpf0603d10ke-te+connectivity-22737789; Tolerance: 0.5%; Resistance: 10KΩ; Package: CPF0603; Temperature Range High: +155°C; Series: CPF; Temperature Range Low: -55°C; Device Class L2: Resistors; Ipc Land Pattern Name: RESC15580X45
R9 = CMP-03211-007120-1: CRGP0603 180KΩ 0.25W ±100ppm/°C 1% 50V; Manufacturer Part Number: CRGP0603F180K; Manufacturer: TE; Tolerance: 0.01; ComponentLink2Description: Datasheet; Lead Free: Yes; Value: 180KΩ; Height: 0.55mm; Category: Res; Temperature Range Low: -55°C; RoHS: TRUE; Temperature: -55°C to +155°C; Temperature Range High: +155°C; Temperature Coefficient: ±100ppm/°C; Resistance: 180KΩ; Power Rating: 0.25W; ComponentLink2URL: https://www.te.com/commerce/DocumentDelivery/DDEController?Action=srchrtrv&DocNm=9-1773463-9&DocType=DS&DocLang=English; Voltage Rating: 50V; Ambient Temperature Range High: +70°C; Device Class L3: Chip SMD Resistors; Device Class L2: Resistors; Composition: Thick Film; Octopart: https://octopart.com/crgp0603f180k-te+connectivity-91018731; Automotive: No; Package: CRGP0603; Device Class L1: Passive Components; Series: CRGP; Ipc Land Pattern Name: RESC16080X45
R10 = CMP-03211-004384-3: RES 1M OHM 1% 1/4W 0603; Resistance: 1MR; Max Power Dissipation: 250mW; Temperature Coefficient: 100ppm/°C; Case Code (Imperial): 0603; Min Operating Temperature: -55°C; Max Operating Temperature: 155°C; RoHS Compliant: Yes; Packaging: Cut Tape; Case/Package: 0603; Tolerance: 1%; Resistor Type: Thick Film; Case Code (Metric): 1608; Number of Terminations: 2
U8 = CMP-0347-00054-2: Boost Voltage Converter with 0.7 to 5.5 V Input and 1.8 to 5.5 V Output, -40 to 85 degC, 6-Pin SC70 (DCK), Green (RoHS & no Sb/Br); Manufacturer: Texas Instruments; SubFamily: Step-Up Regulator; Vout(Min)(V): 1.8; Vout(Max)(V): 5.5; Switching Frequency(Max)(kHz): 2000; Vin(Min)(V): 0.7; Regulated Outputs(#): 1; PackageReference: DCK0006A; PackageVersion: revG, Jan-2007; ComponentLink2Description: Package Specification; Topology: Boost; ComponentLink2URL: http://www.ti.com/litv/pdf/mpds114c; PackageDescription: 6-Pin Plastic Small-Outline Package, 2 x 1.3 mm Body, 0.65 mm Pitch, 2.1 mm Lead Span; ComponentLink1Description: Datasheet; DatasheetVersion: SLVS776; ComponentLink1URL: http://www.ti.com/general/docs/lit/getliterature.tsp?genericPartNumber=TPS61220&fileType=pdf; PartNumber: TPS61220DCKR; Code_JEDEC: MO-203-AB; Eco-Plan: Green (RoHS & no Sb/Br); Vin(Max)(V): 5.5; Mounting Technology: Surface Mount

## Sheet Flash&PSRAM.SchDoc
size Letter; SheetNumber: 5; SheetTotal: 5
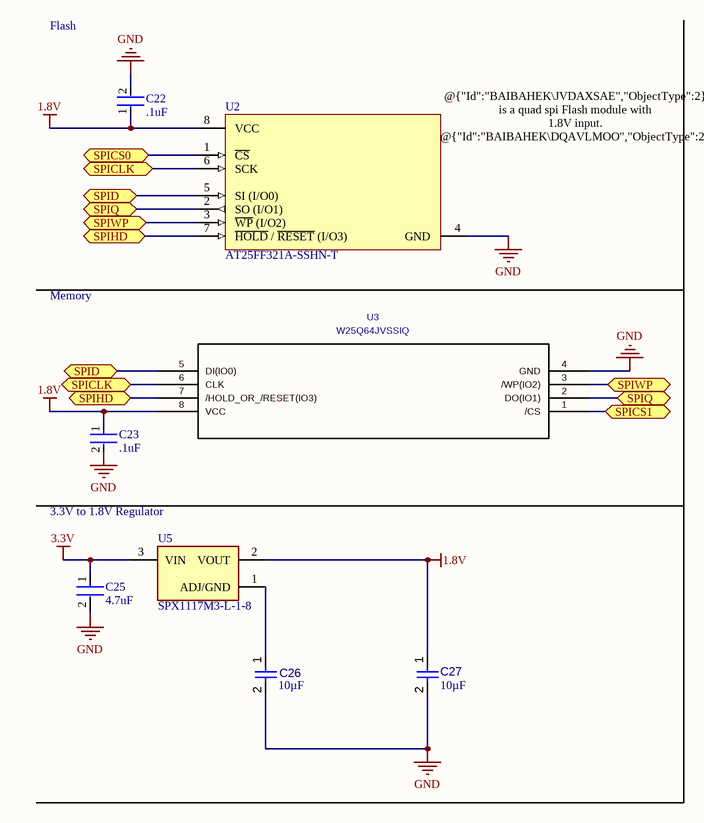
[diagram p4: Flash&PSRAM.SchDoc]

### Parts
C22  .1uF  [FP-GRM033-0_03-IPC_A]
C23  .1uF  [FP-GRM033-0_03-IPC_A]
C25  4.7uF  [FP-RDE3P1-MFG]
C26  value 10µF  [CAPC0603(1608)100_L]  (hidden comment: 10uF)
C27  value 10µF  [CAPC0603(1608)100_L]  (hidden comment: 10uF)
U2  AT25FF321A-SSHN-T  [M8_15_MFG]
U3  W25Q64JVSSIQ  [SOIC127P790X216-8N]
U5  SPX1117M3-L-1-8  [SOT230P700X180-3N]

### Ports
SPICLK (bidir), SPICS0 (bidir), SPICS1 (bidir), SPID (bidir), SPIHD (bidir), SPIQ (bidir), SPIWP (bidir)

### Nets
1.8V: C22.1 C23.1 C27.1 U2.8(VCC) U3.8(VCC) U5.2(VOUT)
3.3V: C25.1 U5.3(VIN)
GND: C22.2 C23.2 C25.2 C26.2 C27.2 U2.4(GND) U3.4(GND)
NetC26_1: C26.1 U5.1(ADJ/GND)
NetU1_28: U3.1(/CS) ; port SPICS1
NetU1_30: U2.7(~{HOLD}_/_~{RESET}_(I/O3)) U3.7(/HOLD_OR_/RESET(IO3)) ; port SPIHD
NetU1_31: U2.3(~{WP}_(I/O2)) U3.3(/WP(IO2)) ; port SPIWP
NetU1_32: U2.1(~{CS}) ; port SPICS0
NetU1_33: U2.6(SCK) U3.6(CLK) ; port SPICLK
NetU1_34: U2.2(SO_(I/O1)) U3.2(DO(IO1)) ; port SPIQ
NetU1_35: U2.5(SI_(I/O0)) U3.5(DI(IO0)) ; port SPID

### Notes on the sheet
- Flash
- @{"Id":"BAIBAHEK\JVDAXSAE","ObjectType":2} is a quad spi Flash module with 1.8V input. @{"Id":"BAIBAHEK\DQAVLMOO","ObjectType":2} is a quad spi PSRAM module with 1.8V input
- Memory
- 3.3V to 1.8V Regulator

### Library data of the parts
C22 C23 = CMP-06035-043202-1: as C5 on sheet RxTx
C25 = CMP-00260-148573962-1: as C29 on sheet USB; Case/Package: Radial; Height: 7.5mm; Lifecycle Status: Production; Min Operating Temperature: -55°C; Max Operating Temperature: 125°C
C26 C27 = CMP-001-00075-4: as C8 on sheet RxTx; Voltage Rating: 10V; Max Operating Temperature: 85°C; Pins: 2; Case/Package: 0603; Mounting Technology: SMT; Min Operating Temperature: -55°C
U2 = CMP-00572-125972999-1: 32Mbit, 1.65 V to 3.6 V SPI Serial Flash Memory with Multi-I/O Support; Manufacturer Lifecycle Status: ACTIVE; Pitch: 1.27mm; ComponentLink2URL: https://octopart.com/cad-content/api/get-model-datasheet/15189/125972999; ComponentLink1Description: Manufacturer's Website; Export Control Classification Number (ECCN) Code: 3A991; ComponentLink1URL: http://www.renesas.com; Package Quantity: 4000; ComponentLink3Description: Manufacturer's Package Drawing; ComponentLink3URL: https://www.renesas.com/en/document/psc/m815-8-lead-narrow-body-small-outline-plastic-package; Harmonized Tariff Schedule (HTS) Code: 8542.32.00.51; Packaging: Tape & Reel; RoHS: Compliant; Part Family: AT25FF321A; MSL: 1; HelpURL: https://octopart.com/cad-content/api/get-model-datasheet/15189/125972999; ComponentLink2Description: Datasheet URL; Lifecycle Status: Production
U3 = W25Q64JVSSIQ: FLASH - NOR Memory IC 64Mbit SPI - Quad I/O 133 MHz 8-SOIC; Manufacturer_Name: Winbond; C: Copyright (C) 2018 Accelerated Designs. All rights reserved; Value: W25Q64JVSSIQ; Copyright: Copyright (C) 2025 Ultra Librarian. All rights reserved.; Manufacturer_Part_Number: W25Q64JVSSIQ
U5 = CMP-031-00006-1: Linear Voltage Regulator IC Positive Fixed 1 Output 800mA SOT-223-3; MF: MaxLinear, Inc.; MP: SPX1117M3-L-1-8/TR; Source: SPX1117M3-L-1-8.SchLib; SnapEDA_Link: https://www.snapeda.com/parts/SPX1117M3-L-1-8/TR/MaxLinear/view-part/?ref=snap; Case/Package: SOT-223 MaxLinear; Design Item ID: SPX1117M3-L-1-8; Component Type: Standard; Check_prices: https://www.snapeda.com/parts/SPX1117M3-L-1-8/TR/MaxLinear/view-part/?ref=eda; Pins: 3; Value: *

## Nets that join several sheets
1.8V: RxTx (C16.1 C17.1 U1.29), Flash&PSRAM (6 pins)
3.3V: RxTx (18 pins), Cam (6 pins), USB (8 pins), Flash&PSRAM (C25.1 U5.3)
3.3VUSB: RxTx (SW3.1), USB (C31.1 U6.2)
GND: RxTx (28 pins), Cam (5 pins), USB (14 pins), PowerReg (5 pins), Flash&PSRAM (7 pins)
Vbat: RxTx (SW3.3), PowerReg (C35.1 R9.2 U8.4)
cam_reset: RxTx (U1.41), Cam (J1.6)
href: RxTx (U1.39), Cam (J1.9)
NetP1_2: RxTx (U1.7), USB (P1.2)
NetP2_2: RxTx (U1.10), USB (P2.2)
NetP3_2: RxTx (U1.43), USB (P3.2)
NetP4_2: RxTx (U1.6), USB (P4.2)
NetU1_28: RxTx (U1.28), Flash&PSRAM (U3.1)
NetU1_30: RxTx (U1.30), Flash&PSRAM (U2.7 U3.7)
NetU1_31: RxTx (U1.31), Flash&PSRAM (U2.3 U3.3)
NetU1_32: RxTx (U1.32), Flash&PSRAM (U2.1)
NetU1_33: RxTx (U1.33), Flash&PSRAM (U2.6 U3.6)
NetU1_34: RxTx (U1.34), Flash&PSRAM (U2.2 U3.2)
NetU1_35: RxTx (U1.35), Flash&PSRAM (U2.5 U3.5)
pclk: RxTx (U1.27), Cam (J1.17)
pwdn: RxTx (U1.42), Cam (J1.8)
SCL: RxTx (U1.12), Cam (J1.5 R11.2)
SDA: RxTx (U1.13), Cam (J1.3 R12.2)
USB1_N: RxTx (C12.1 R2.2), USB (J2.2 R5.1)
USB1_P: RxTx (C13.1 R3.2), USB (J2.3 R4.1)
vsync: RxTx (U1.38), Cam (J1.7)
xclk: RxTx (U1.40), Cam (J1.13)